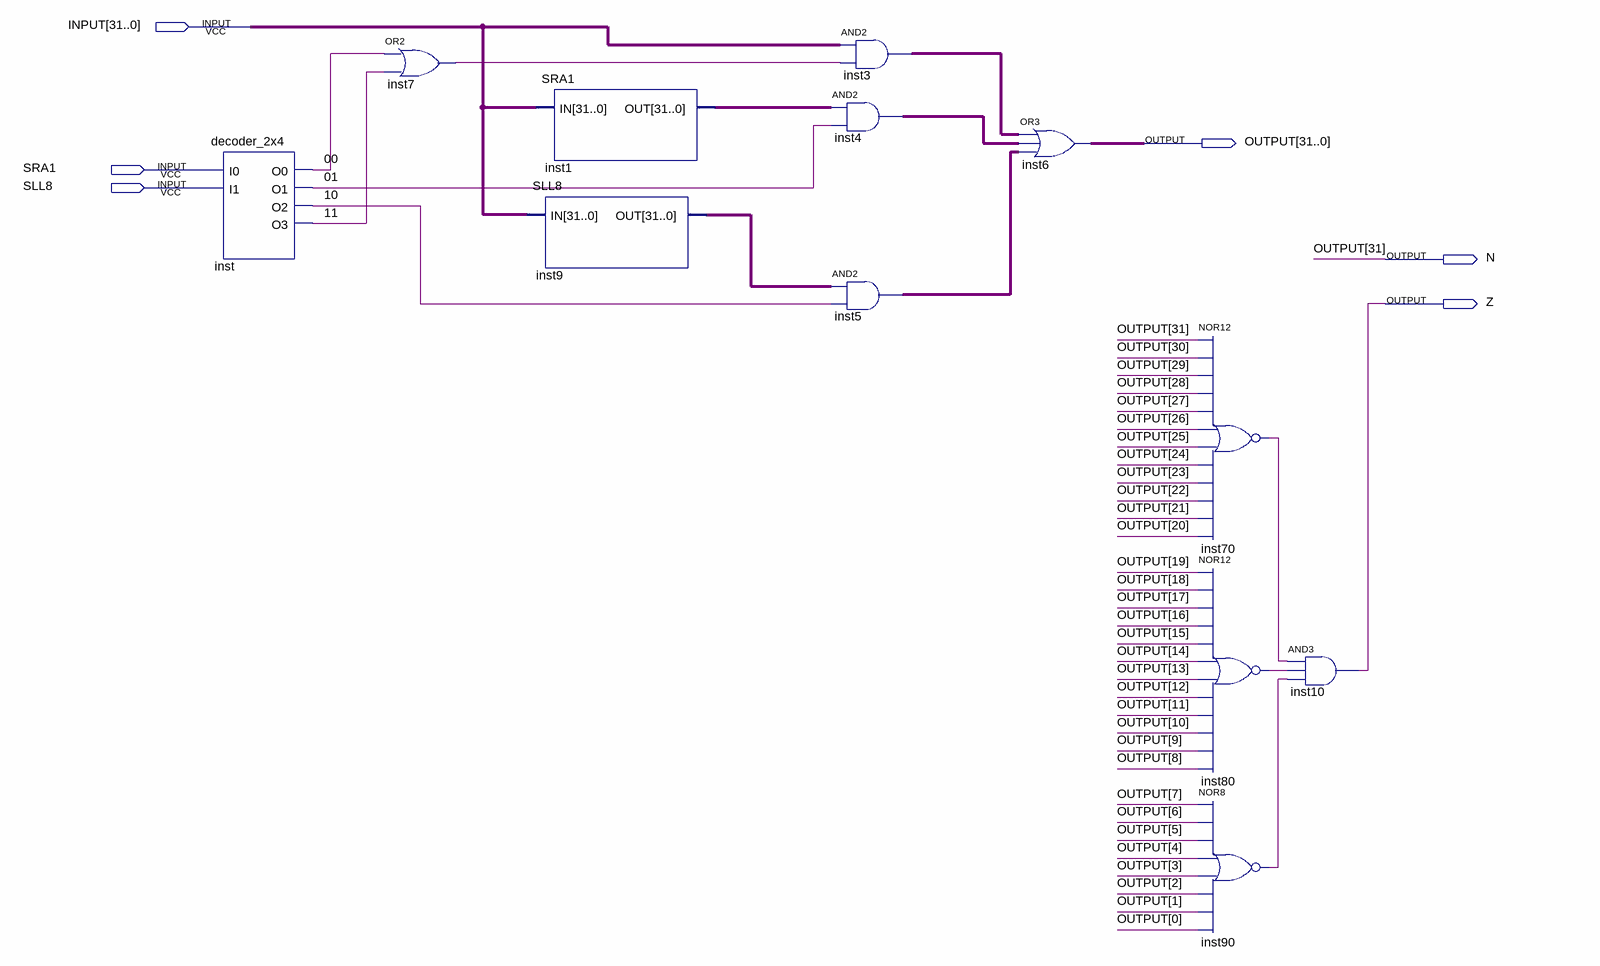
[diagram p0: schematic sheet]
// Quartus schematic Shifter.bdf as structural Verilog: 12 symbols, 6 pins
module Shifter (
  input  [31:0] INPUT,
  input  SRA1,
  input  SLL8,
  output [31:0] OUTPUT,
  output N,
  output Z
);

  wire \00 , \01 , \10 , \11 , inst7_out, inst70_out, inst80_out, inst90_out;
  wire [31:0] inst1_out, inst3_out, inst4_out, inst5_out, inst9_out;

  decoder_2x4 inst (.I0(SRA1), .I1(SLL8), .O0(\00 ), .O1(\01 ), .O2(\10 ), .O3(\11 ));
  or inst7 (inst7_out, \00 , \11 );
  SRA1 inst1 (.IN(INPUT), .OUT(inst1_out));
  SLL8 inst9 (.IN(INPUT), .OUT(inst9_out));
  assign inst3_out = INPUT & {32{inst7_out}};  // AND2 inst3, 32 bits wide
  assign inst4_out = inst1_out & {32{\01 }};  // AND2 inst4, 32 bits wide
  assign inst5_out = inst9_out & {32{\10 }};  // AND2 inst5, 32 bits wide
  assign {N, OUTPUT[30:0]} = inst3_out | inst4_out | inst5_out;  // OR3 inst6, 32 bits wide
  nor inst70 (inst70_out, N, OUTPUT[30], OUTPUT[29], OUTPUT[28], OUTPUT[27], OUTPUT[26], OUTPUT[25], OUTPUT[24], OUTPUT[23], OUTPUT[22], OUTPUT[21], OUTPUT[20]);
  nor inst80 (inst80_out, OUTPUT[19], OUTPUT[18], OUTPUT[17], OUTPUT[16], OUTPUT[15], OUTPUT[14], OUTPUT[13], OUTPUT[12], OUTPUT[11], OUTPUT[10], OUTPUT[9], OUTPUT[8]);
  nor inst90 (inst90_out, OUTPUT[7], OUTPUT[6], OUTPUT[5], OUTPUT[4], OUTPUT[3], OUTPUT[2], OUTPUT[1], OUTPUT[0]);
  and inst10 (Z, inst70_out, inst80_out, inst90_out);

  assign OUTPUT[31] = N;
endmodule
